# EasyEDA schematic 1-Schematic_Arduino uno.json
TITLE: Sheet_1; REV: 1.0; Date: 2025-03-01; Sheet: 1/1; Drawn By: 211256; Company: Your Company
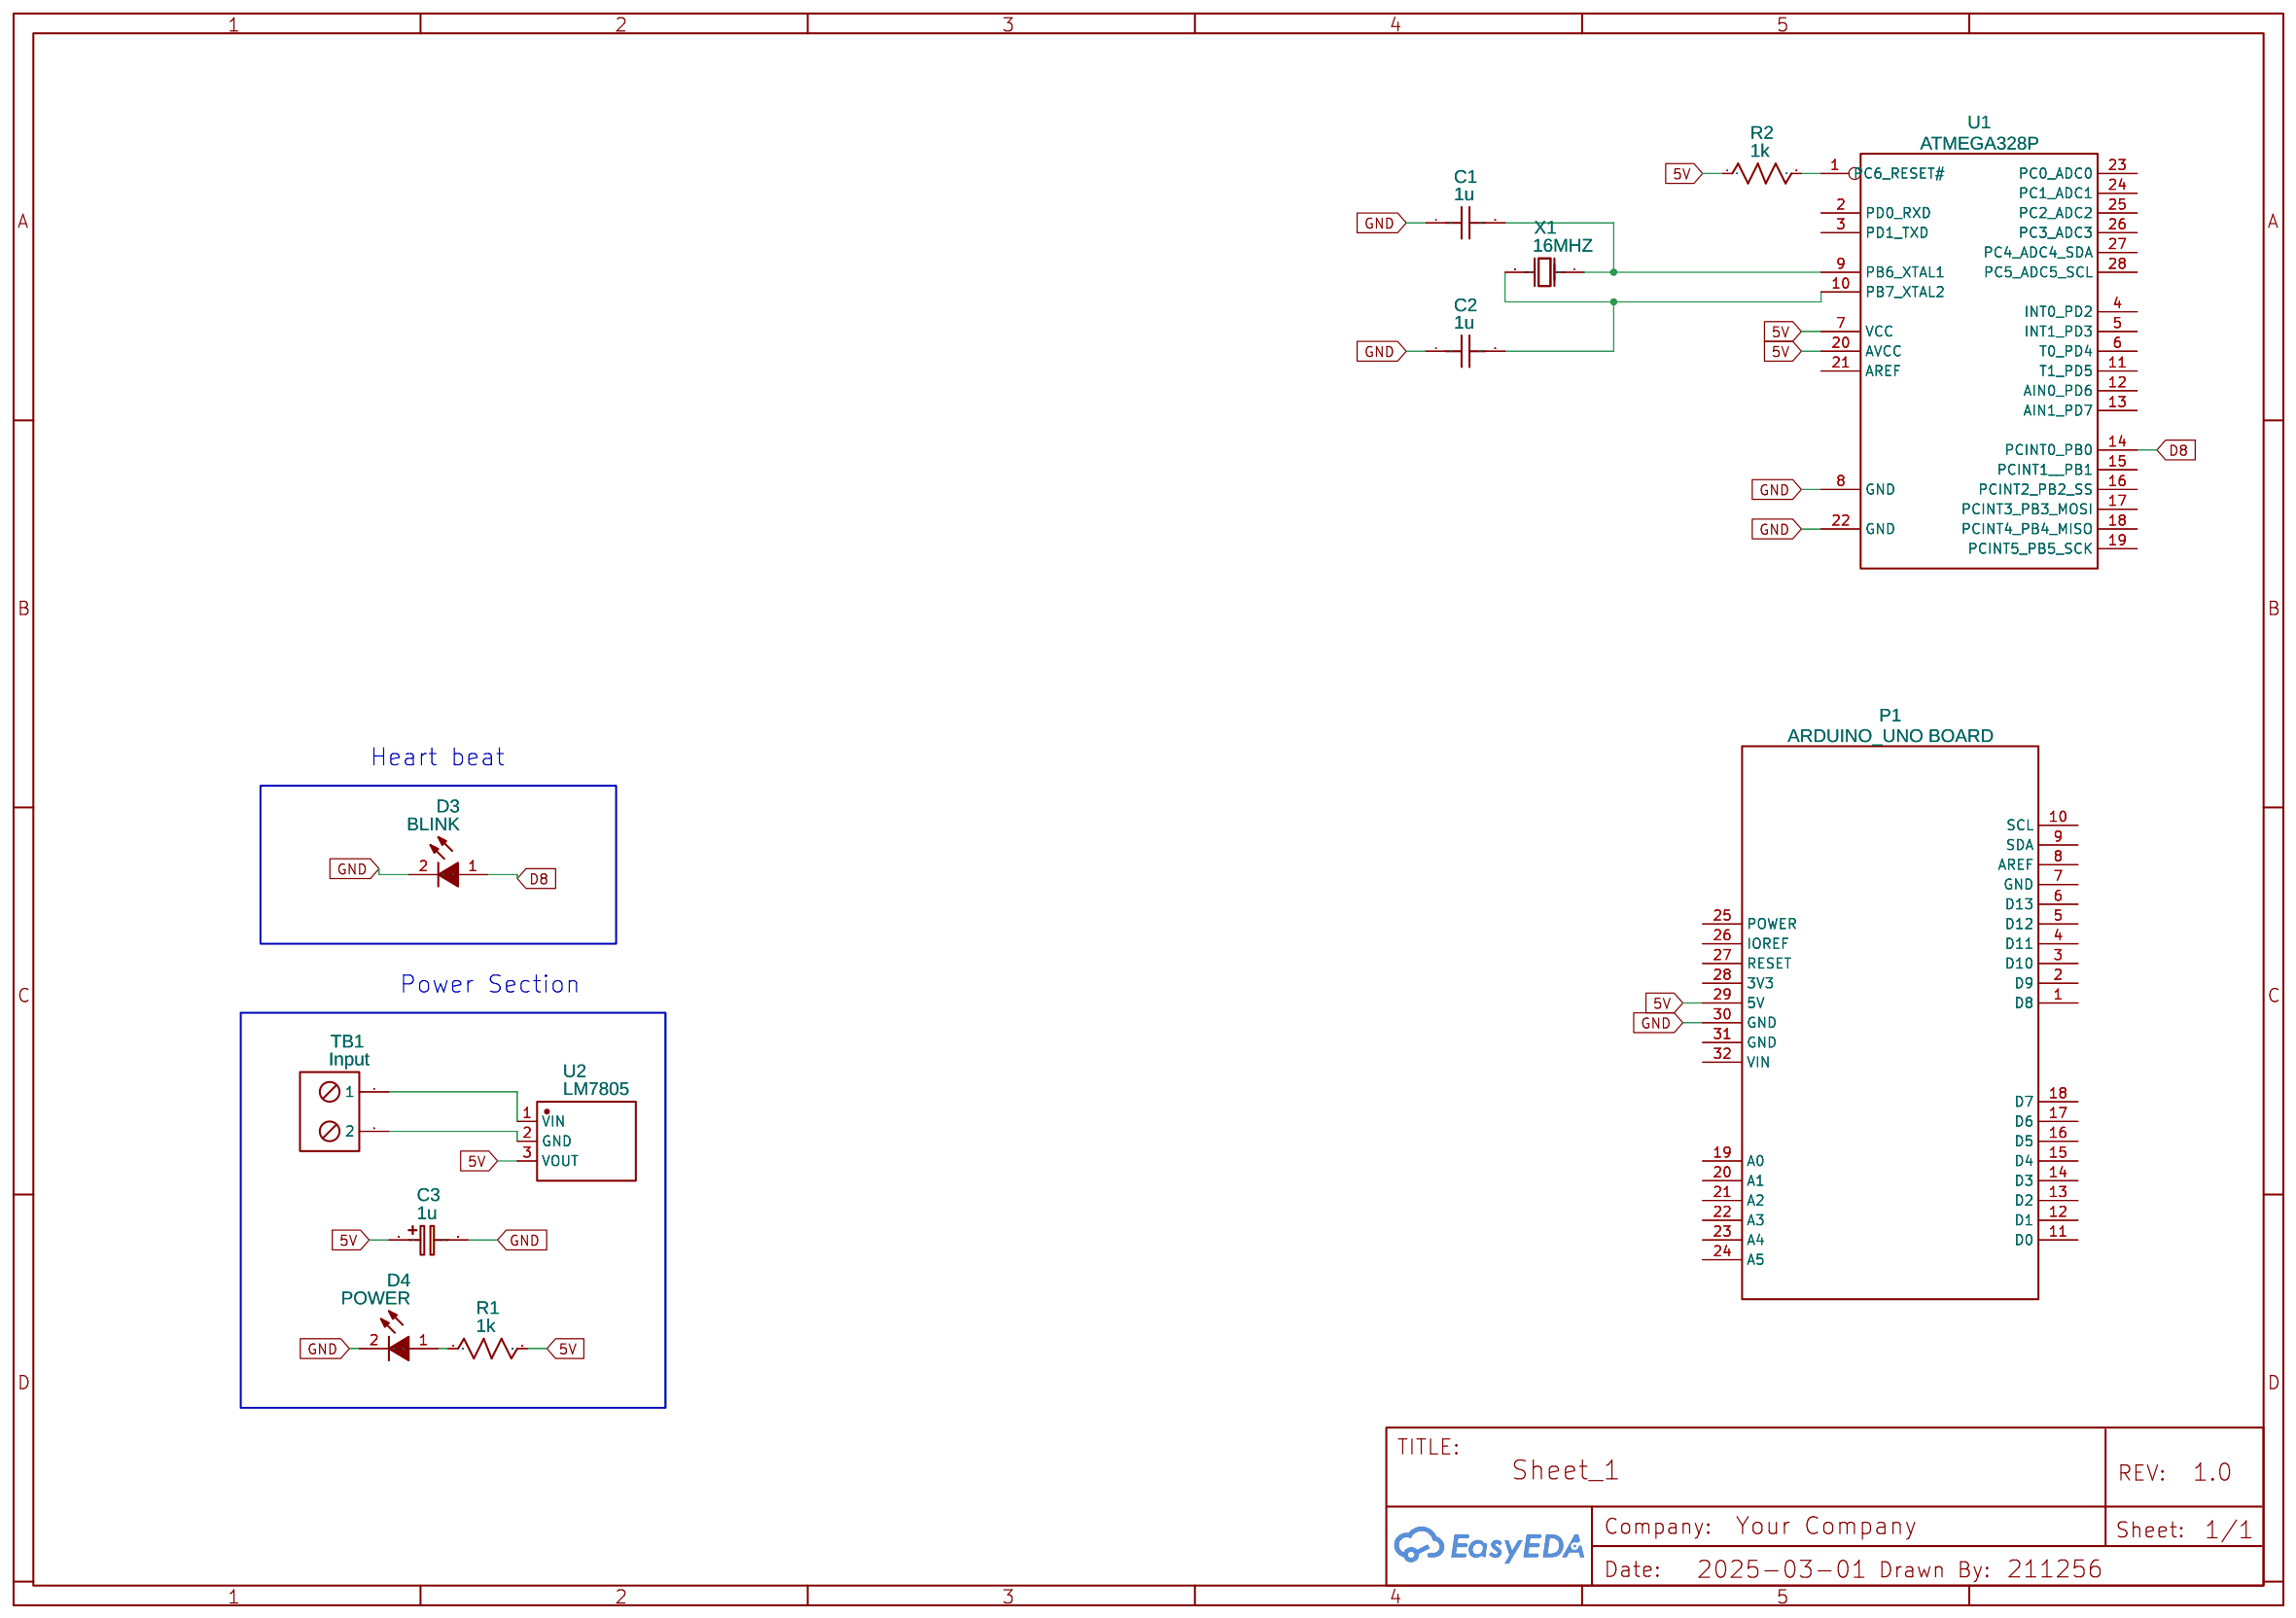
[diagram p0: schematic sheet]

## Parts
C1  1u  [RAD-0.1]
C2  1u  [RAD-0.1]
C3  1u  [CAP-D3.0×F1.5]
D3  BLINK  [LED-TH_LED-DP2-2LED-AMCC]
D4  POWER  [LED-TH_LED-DP2-2LED-AMCC]
P1  ARDUINO_UNO BOARD  [UNO_R3]
R1  1k  [R_AXIAL-0.3]
R2  1k  [R_AXIAL-0.3]
TB1  Input  [TBLOCK-X2]
U1  ATMEGA328P  [ATMEGA328P-PU GT]
U2  LM7805  [TO-220F-3_L10.2-W4.7-P2.54-L]
X1  16MHZ  [COS-16MHZ]

## Library data of the parts
C1 C2 = C_RAD-0.1_US: Contributor: LCEDA_Lib
C3 = CE_TH_D3.0×F1.5_EU: Contributor: LCEDA_Lib
D3 D4 = LED 5x7 DIP: Manufacturer: VccLite; Manufacturer Part: 5600; Supplier Part: L20325-ND; link: https://vcclite.com/product/5602f5-5v/; Contributor: grigorij1
P1 = ARDUINO_UNO BOARD COPY: sourceId: 1T5FDZYC8; Contributor: 211256
R1 R2 = R_AXIAL-0.3_US: Contributor: LCEDA_Lib
TB1 = TBLOCK-X2: Contributor: ahmedyerli
U1 = ATMEGA328P-PU GT: sourceId: Oic6oiASL; Supplier: LCSC; Manufacturer: MICROCHIP; Manufacturer Part: ATMEGA328P-PU; Contributor: George Telas; Supplier Part: C33901; JLCPCB Part Class: Extended Part
U2 = LM7805G-TF3-T: Contributor: LCSC; Supplier: LCSC; Supplier Part: C213490; Manufacturer: UTC(友顺); JLCPCB Part Class: Extended Part
X1 = CRYSTAL OSCILLATOR-16MHZ: Manufacturer: YXC; Manufacturer Part: X49SD16MSD2SC; Contributor: ihwatama

## Nets
5V: C3.1 P1.29(5V) R1.2 R2.1 U1.7(VCC) U1.20(AVCC) U2.3(VOUT)
GND: C1.1 C2.1 C3.2 D3.2(K) D4.2(K) P1.30(GND) U1.8(GND) U1.22(GND)
D8: D3.1(A) U1.14(PCINT0 PB0)
Net-(C1-2): C1.2 U1.9(PB6 XTAL1) X1.1(OSC1)
Net-(C2-2): C2.2 U1.10(PB7 XTAL2) X1.2(OSC2)
Net-(D4-1): D4.1(A) R1.1
Net-(R2-2): R2.2 U1.1(PC6 RESET#)
Net-(TB1-1): TB1.1 U2.1(VIN)
Net-(TB1-2): TB1.2 U2.2(GND)

Not connected (* = marked no-connect by the designer): P1 1(D8) 2(D9) 3(D10) 4(D11) 5(D12) 6(D13) 7(GND) 8(AREF) 9(SDA) 10(SCL) 11(D0) 12(D1) 13(D2) 14(D3) 15(D4) 16(D5) 17(D6) 18(D7) 19(A0) 20(A1) 21(A2) 22(A3) 23(A4) 24(A5) 25(POWER) 26(IOREF) 27(RESET) 28(3V3) 31(GND) 32(VIN); U1 2(PD0 RXD) 3(PD1 TXD) 4(INT0 PD2) 5(INT1 PD3) 6(T0 PD4) 11(T1 PD5) 12(AIN0 PD6) 13(AIN1 PD7) 15(PCINT1  PB1) 16(PCINT2 PB2 SS) 17(PCINT3 PB3 MOSI) 18(PCINT4 PB4 MISO) 19(PCINT5 PB5 SCK) 21(AREF) 23(PC0 ADC0) 24(PC1 ADC1) 25(PC2 ADC2) 26(PC3 ADC3) 27(PC4 ADC4 SDA) 28(PC5 ADC5 SCL)

## Notes on the sheet
- Heart beat
- Power Section
